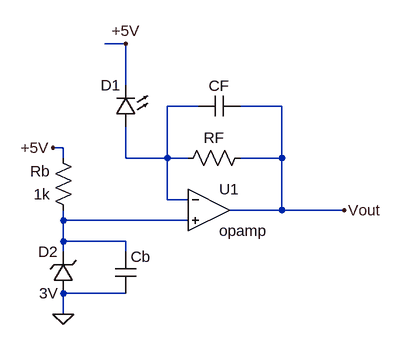
[diagram p0: schematic TransconductanceAmp.asc]
TransconductanceAmp.asc, the LTspice schematic file:
Version 4
SHEET 1 880 680
WIRE 96 -96 64 -96
WIRE 96 -32 96 -96
WIRE 208 0 160 0
WIRE 336 0 272 0
WIRE 0 64 -16 64
WIRE 0 80 0 64
WIRE 96 80 96 32
WIRE 160 80 160 0
WIRE 160 80 96 80
WIRE 192 80 160 80
WIRE 336 80 336 0
WIRE 336 80 272 80
WIRE 160 144 160 80
WIRE 192 144 160 144
WIRE 336 160 336 80
WIRE 336 160 256 160
WIRE 432 160 336 160
WIRE 0 176 0 160
WIRE 192 176 0 176
WIRE 0 208 0 176
WIRE 96 208 0 208
WIRE 0 224 0 208
WIRE 96 224 96 208
WIRE 96 288 0 288
WIRE 0 320 0 288
FLAG 0 320 0
FLAG 96 -96 +5V
FLAG -16 64 +5V
FLAG 432 160 Vout
SYMBOL Opamps\\opamp 224 96 R0
SYMATTR InstName U1
SYMBOL res 288 64 R90
WINDOW 0 0 56 VBottom 2
WINDOW 3 32 56 VTop 2
SYMATTR InstName RF
SYMATTR Value ""
SYMBOL res 16 176 R180
WINDOW 0 36 76 Left 2
WINDOW 3 36 40 Left 2
SYMATTR InstName Rb
SYMATTR Value 1k
SYMBOL cap 272 -16 R90
WINDOW 0 0 32 VBottom 2
WINDOW 3 32 32 VTop 2
SYMATTR InstName CF
SYMATTR Value ""
SYMBOL LED 112 32 R180
WINDOW 0 24 64 Left 2
WINDOW 3 24 0 Left 2
SYMATTR InstName D1
SYMATTR Value ""
SYMBOL zener 16 288 R180
WINDOW 0 24 64 Left 2
WINDOW 3 24 0 Left 2
SYMATTR InstName D2
SYMATTR Value 3V
SYMBOL cap 80 224 R0
SYMATTR InstName Cb
SYMATTR Value ""

The netlist it stands for:
* TransconductanceAmp.asc
XU1 N001 N002 Vout opamp Aol=100K GBW=10Meg  ; pins invin noninvin out
RF Vout N001
Rb N002 +5V 1k
CF Vout N001
D1 N001 +5V
D2 0 N002 3V
Cb N002 0
.model D D
.lib standard.dio
.backanno
.end